# Altium schematic sheet CNC_Remote.SchDoc
size 217 x 176 mm; DrawnBy: Mr. Thach
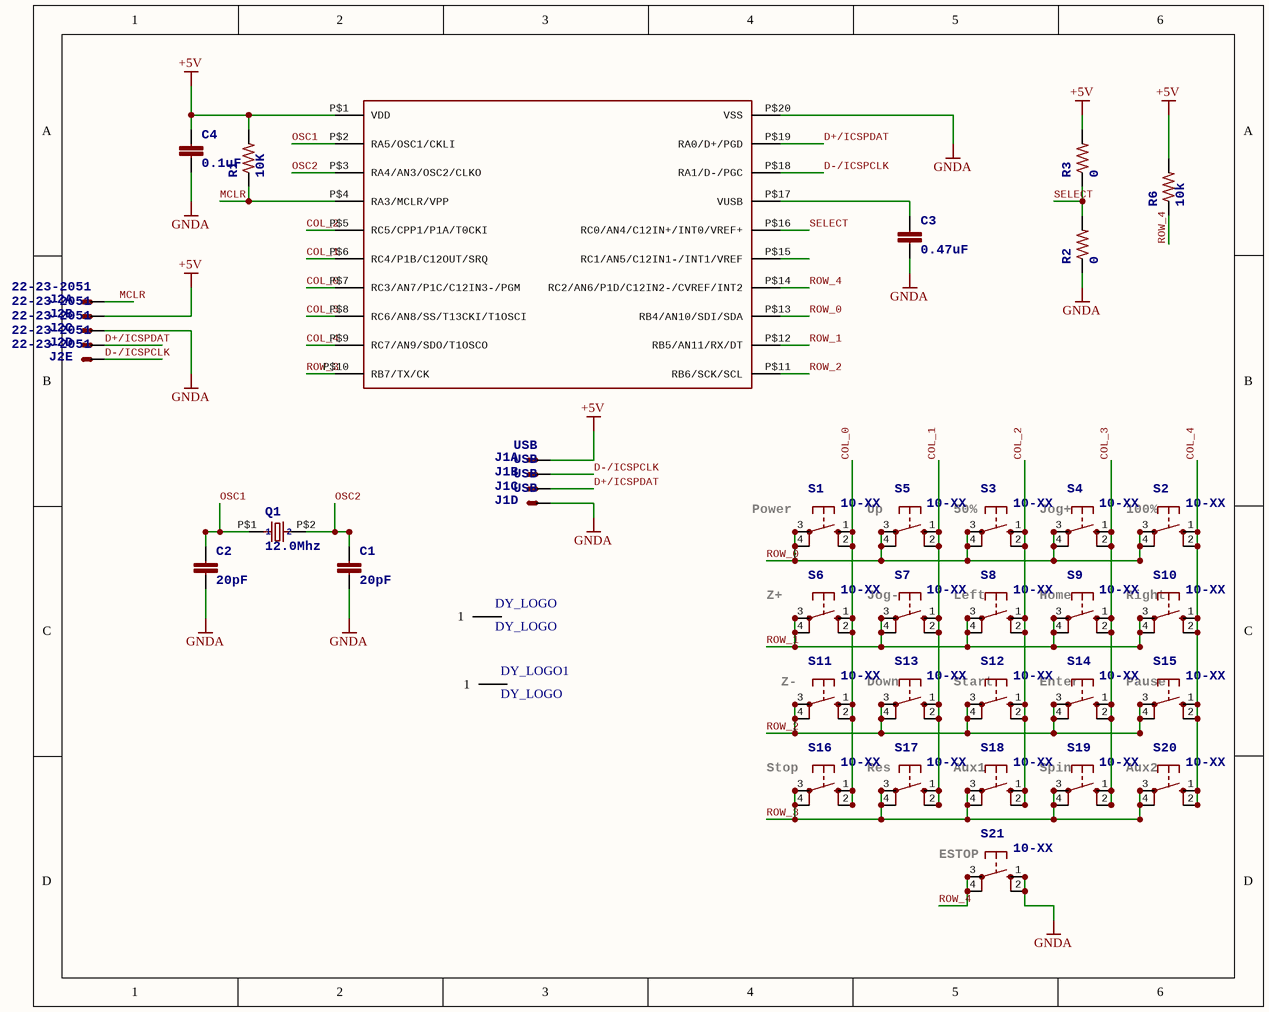
[diagram p0: CNC_Remote.SchDoc]

## Parts
C1  20pF  [C0805]
C2  20pF  [C0805]
C3  0.47uF  [C0805]
C4  0.1uF  [C0805]
DY_LOGO  DY_LOGO  [DY_logo]
DY_LOGO1  DY_LOGO  [DY_logo]
J1  USB  [22-23-2041]  (parts A,B,C,D of 4)
J2  22-23-2051  [22-23-2051]  (parts A,B,C,D,E of 5)
Q1  12.0Mhz  [HC49/US]
R1  10K  [R0805]
R2  0  [R0805]
R3  0  [R0805]
R6  10k  [R0805]
S1  10-XX  [B3F-10XX]
S2  10-XX  [B3F-10XX]
S3  10-XX  [B3F-10XX]
S4  10-XX  [B3F-10XX]
S5  10-XX  [B3F-10XX]
S6  10-XX  [B3F-10XX]
S7  10-XX  [B3F-10XX]
S8  10-XX  [B3F-10XX]
S9  10-XX  [B3F-10XX]
S10  10-XX  [B3F-10XX]
S11  10-XX  [B3F-10XX]
S12  10-XX  [B3F-10XX]
S13  10-XX  [B3F-10XX]
S14  10-XX  [B3F-10XX]
S15  10-XX  [B3F-10XX]
S16  10-XX  [B3F-10XX]
S17  10-XX  [B3F-10XX]
S18  10-XX  [B3F-10XX]
S19  10-XX  [B3F-10XX]
S20  10-XX  [B3F-10XX]
S21  10-XX  [B3F-10XX]
U1  PIC18F1*K50SOIC  [SOIC-20]  (value not drawn)

## Nets
+5V: C4.1 J1.1(S) J2.2(S) R1.2 R3.2 R6.2 U1.P$1(VDD)
GNDA: C1.2 C2.2 C3.2 C4.2 J1.4(S) J2.3(S) R2.1 S21.1(S) S21.2(S1) U1.P$20(VSS)
COL_0: S1.1(S) S1.2(S1) S6.1(S) S6.2(S1) S11.1(S) S11.2(S1) S16.1(S) S16.2(S1) U1.P$7(RC3/AN7/P1C/C12IN3-/PGM)
COL_1: S5.1(S) S5.2(S1) S7.1(S) S7.2(S1) S13.1(S) S13.2(S1) S17.1(S) S17.2(S1) U1.P$6(RC4/P1B/C12OUT/SRQ)
COL_2: S3.1(S) S3.2(S1) S8.1(S) S8.2(S1) S12.1(S) S12.2(S1) S18.1(S) S18.2(S1) U1.P$5(RC5/CPP1/P1A/T0CKI)
COL_3: S4.1(S) S4.2(S1) S9.1(S) S9.2(S1) S14.1(S) S14.2(S1) S19.1(S) S19.2(S1) U1.P$8(RC6/AN8/SS/T13CKI/T1OSCI)
COL_4: S2.1(S) S2.2(S1) S10.1(S) S10.2(S1) S15.1(S) S15.2(S1) S20.1(S) S20.2(S1) U1.P$9(RC7/AN9/SDO/T1OSCO)
D+/ICSPDAT: J1.3(S) J2.4(S) U1.P$19(RA0/D+/PGD)
D-/ICSPCLK: J1.2(S) J2.5(S) U1.P$18(RA1/D-/PGC)
MCLR: J2.1(S) R1.1 U1.P$4(RA3/MCLR/VPP)
OSC1: C2.1 Q1.P$1 U1.P$2(RA5/OSC1/CKLI)
OSC2: C1.1 Q1.P$2 U1.P$3(RA4/AN3/OSC2/CLKO)
ROW_0: S1.3(P) S1.4(P1) S2.3(P) S2.4(P1) S3.3(P) S3.4(P1) S4.3(P) S4.4(P1) S5.3(P) S5.4(P1) U1.P$13(RB4/AN10/SDI/SDA)
ROW_1: S6.3(P) S6.4(P1) S7.3(P) S7.4(P1) S8.3(P) S8.4(P1) S9.3(P) S9.4(P1) S10.3(P) S10.4(P1) U1.P$12(RB5/AN11/RX/DT)
ROW_2: S11.3(P) S11.4(P1) S12.3(P) S12.4(P1) S13.3(P) S13.4(P1) S14.3(P) S14.4(P1) S15.3(P) S15.4(P1) U1.P$11(RB6/SCK/SCL)
ROW_3: S16.3(P) S16.4(P1) S17.3(P) S17.4(P1) S18.3(P) S18.4(P1) S19.3(P) S19.4(P1) S20.3(P) S20.4(P1) U1.P$10(RB7/TX/CK)
ROW_4: R6.1 S21.3(P) S21.4(P1) U1.P$14(RC2/AN6/P1D/C12IN2-/CVREF/INT2)
SELECT: R2.2 R3.1 U1.P$16(RC0/AN4/C12IN+/INT0/VREF+)
NetC3_1: C3.1 U1.P$17(VUSB)

Not connected (* = marked no-connect by the designer): DY_LOGO 1; DY_LOGO1 1; U1 P$15(RC1/AN5/C12IN1-/INT1/VREF)

## Notes on the sheet
- (near S1) Power
- Up
- (near S3) 50%
- (near S4) Jog+
- (near S2) 100%
- Z+
- (near S7) Jog-
- (near S8) Left
- (near S9) Home
- (near S10) Right
- (near S11) Z-
- (near S13) Down
- (near S12) Start
- (near S14) Enter
- (near S15) Pause
- (near S16) Stop
- (near S17) Res
- (near S18) Aux1
- (near S19) Spin
- (near S20) Aux2
- (near S21) ESTOP

## Library data of the parts
C1-C4 = C-EUC0603: <B>CAPACITOR</B>, European symbol
J1 = 22-23-2041: .100" (2.54mm) Center Header - 4 Pin; MF: MOLEX; MPN: 22-23-2041; OC_FARNELL: 1462920; OC_NEWARK: 38C0355
J2 = 22-23-2051: .100" (2.54mm) Center Header - 5 Pin; MF: MOLEX; MPN: 22-23-2051; OC_FARNELL: 1462952; OC_NEWARK: 38C9178
Q1 = CSM-3X: 1: 1; 2: 2
R1-R3 R6 = R-US_R0603: <B>RESISTOR</B>, American symbol
S1-S21 = 10-XX: <b>OMRON SWITCH</b>; MPN: B3F-1000; OC_FARNELL: 176432; OC_NEWARK: 36M3542